# Altium schematic sheet R3D902.SchDoc
size A
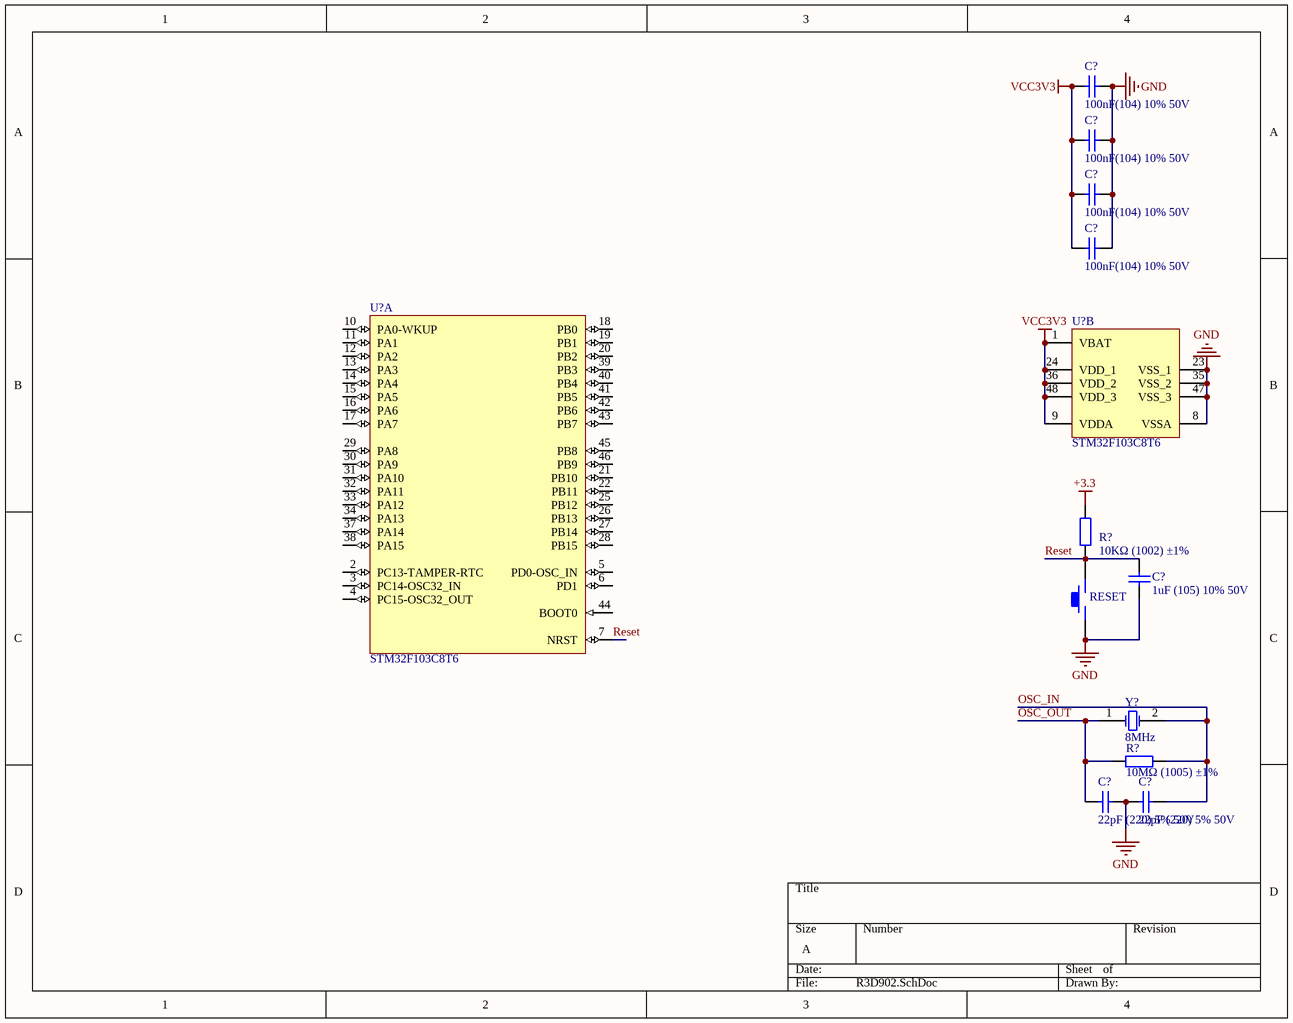
[diagram p0: R3D902.SchDoc]

## Parts
(Parts that share a designator on the sheet are numbered #1, #2 ... from top to bottom, then left to right.)
C?#1  100nF(104) 10% 50V  [LC-0805_C]
C?#2  100nF(104) 10% 50V  [LC-0805_C]
C?#3  100nF(104) 10% 50V  [LC-0805_C]
C?#4  100nF(104) 10% 50V  [LC-0805_C]
C?#5  1uF (105) 10% 50V  [LC-0805_C]
C?#6  22pF (220) 5% 50V  [LC-0805_C]
C?#7  22pF (220) 5% 50V  [LC-0805_C]
R?#1  10KΩ (1002) ±1%  [LC-0805_R]
R?#2  10MΩ (1005) ±1%  [LC-0805_R]
RESET  KEY_M  [KEY_M]  (value not drawn)
U?#1  STM32F103C8T6  [LC-LQFP-48_7x7x05P]  (part B of 2)
U?#2  STM32F103C8T6  [LC-LQFP-48_7x7x05P]  (part A of 2)
Y?  8MHz  [XTAL_US]

## Nets
+3.3: R?#1.2
GND: C?#1.1 C?#2.1 C?#3.1 C?#4.1 C?#5.1 C?#6.2 C?#7.1 RESET.1 U?#1.8(VSSA) U?#1.23(VSS_1) U?#1.35(VSS_2) U?#1.47(VSS_3)
VCC3V3: C?#1.2 C?#2.2 C?#3.2 C?#4.2 U?#1.1(VBAT) U?#1.9(VDDA) U?#1.24(VDD_1) U?#1.36(VDD_2) U?#1.48(VDD_3)
OSC_IN: C?#7.2 R?#2.2 Y?.2(OSC2)
OSC_OUT: C?#6.1 R?#2.1 Y?.1(OSC1)
Reset: C?#5.2 R?#1.1 RESET.2 U?#2.7(NRST)

Not connected (* = marked no-connect by the designer): U?#2 2(PC13-TAMPER-RTC) 3(PC14-OSC32_IN) 4(PC15-OSC32_OUT) 5(PD0-OSC_IN) 6(PD1) 10(PA0-WKUP) 11(PA1) 12(PA2) 13(PA3) 14(PA4) 15(PA5) 16(PA6) 17(PA7) 18(PB0) 19(PB1) 20(PB2) 21(PB10) 22(PB11) 25(PB12) 26(PB13) 27(PB14) 28(PB15) 29(PA8) 30(PA9) 31(PA10) 32(PA11) 33(PA12) 34(PA13) 37(PA14) 38(PA15) 39(PB3) 40(PB4) 41(PB5) 42(PB6) 43(PB7) 44(BOOT0) 45(PB8) 46(PB9)

## Library data of the parts
C?#1-C?#4 = 0805 100nF(104) 10% 50V: 贴片电容; ComponentLink1Description: 供应商链接; ComponentLink1URL: http://www.szlcsc.com/product/details_50686.html; Package: 0805; Supplier: LC; SuppliersPartNumber: C49678
C?#5 = 0805 1uF (105) 10% 50V: 贴片电容; ComponentLink1Description: 供应商链接; ComponentLink1URL: http://www.szlcsc.com/product/details_29074.html; Package: 0805; Supplier: LC; SuppliersPartNumber: C28323
C?#6 C?#7 = 0805 22pF (220) 5% 50V: 贴片电容; ComponentLink1Description: 供应商链接; ComponentLink1URL: http://www.szlcsc.com/product/details_2156.html; Package: 0805; Supplier: LC; SuppliersPartNumber: C1804
R?#1 = 0805 10KΩ (1002) 1%: 贴片电阻; ComponentLink1Description: 供应商链接; ComponentLink1URL: http://www.szlcsc.com/product/details_18102.html; Package: 0805; Supplier: LC; SuppliersPartNumber: C17414
R?#2 = 0805 10MΩ (1005) 1%: 贴片电阻; ComponentLink1Description: 供应商链接; ComponentLink1URL: http://www.szlcsc.com/product/details_26851.html; Package: 0805; Supplier: LC; SuppliersPartNumber: C26108
U?#1 U?#2 = STM32F103C8T6: ARM; ComponentLink1Description: 供应商链接; ComponentLink1URL: http://www.szlcsc.com/product/details_9243.html; Package: LQFP-48_7x7x05P; Supplier: LC; SuppliersPartNumber: C8734
Y? = XTAL: Crystal Oscillator; Published: 8-Jun-2000; LatestRevisionDate: 17-Jul-2002; LatestRevisionNote: Re-released for DXP Platform.; Publisher: Altium Limited